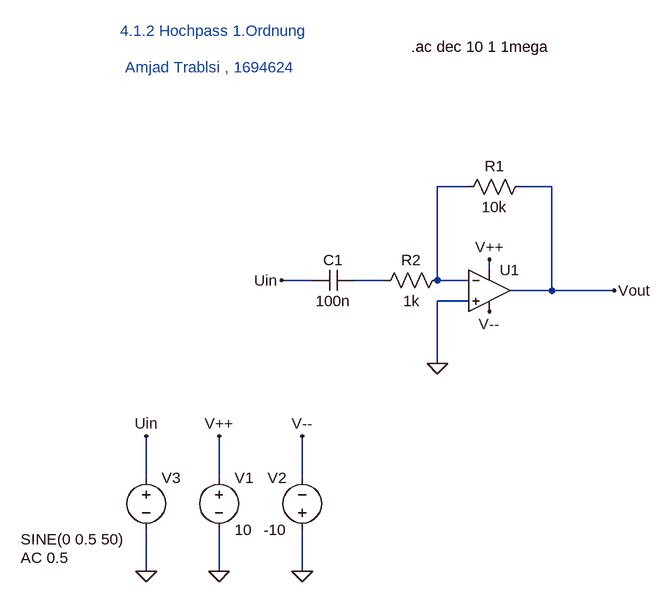
[diagram p0: schematic 4_1_2 hochpass_1_Ordnung_2.asc]
4_1_2 hochpass_1_Ordnung_2.asc, the LTspice schematic file:
Version 4
SHEET 1 1052 680
WIRE 512 -32 464 -32
WIRE 640 -32 592 -32
WIRE 544 96 544 80
WIRE 272 112 224 112
WIRE 384 112 336 112
WIRE 464 112 464 -32
WIRE 512 112 464 112
WIRE 640 128 640 -32
WIRE 640 128 576 128
WIRE 736 128 640 128
WIRE 512 144 464 144
WIRE 464 240 464 144
WIRE 16 416 16 352
WIRE 128 416 128 352
WIRE 256 416 256 352
WIRE 16 560 16 496
WIRE 128 560 128 496
WIRE 256 560 256 496
FLAG 128 560 0
FLAG 128 352 V++
FLAG 544 80 V++
FLAG 256 560 0
FLAG 256 352 V--
FLAG 544 160 V--
FLAG 736 128 Vout
FLAG 16 560 0
FLAG 16 352 Uin
FLAG 224 112 Uin
FLAG 464 240 0
SYMBOL res 608 -48 R90
WINDOW 0 0 56 VBottom 2
WINDOW 3 32 56 VTop 2
SYMATTR InstName R1
SYMATTR Value 10k
SYMBOL voltage 128 400 R0
WINDOW 123 0 0 Left 0
WINDOW 39 0 0 Left 0
SYMATTR InstName V1
SYMATTR Value 10
SYMBOL voltage 256 512 R180
WINDOW 0 24 96 Left 2
WINDOW 3 24 16 Left 2
WINDOW 123 0 0 Left 0
WINDOW 39 0 0 Left 0
SYMATTR InstName V2
SYMATTR Value -10
SYMBOL voltage 16 400 R0
WINDOW 3 -193 111 Left 2
WINDOW 123 -193 139 Left 2
WINDOW 39 0 0 Left 0
SYMATTR Value SINE(0 0.5 50)
SYMATTR Value2 AC 0.5
SYMATTR InstName V3
SYMBOL cap 336 96 R90
WINDOW 0 0 32 VBottom 2
WINDOW 3 32 32 VTop 2
SYMATTR InstName C1
SYMATTR Value 100n
SYMBOL res 480 96 R90
WINDOW 0 0 56 VBottom 2
WINDOW 3 32 56 VTop 2
SYMATTR InstName R2
SYMATTR Value 1k
SYMBOL OpAmps/UniversalOpAmp 544 128 R0
SYMATTR InstName U1
TEXT -24 -272 Left 2 ;4.1.2 Hochpass 1.Ordnung
TEXT 424 -248 Left 2 !.ac dec 10 1 1mega
TEXT -16 -216 Left 2 ;Amjad Trablsi , 1694624

The netlist it stands for:
* 4_1_2 hochpass_1_Ordnung_2.asc
R1 Vout N001 10k
V1 V++ 0 10
V2 0 V-- -10
V3 Uin 0 SINE(0 0.5 50) AC 0.5
C1 N002 Uin 100n
R2 N001 N002 1k
XU1 0 N001 V++ V-- Vout level1 Avol=1Meg GBW=10Meg Vos=0 En=0 Enk=0 In=0 Ink=0 Rin=500Meg  ; pins In+ In- V+ V- OUT
* 4.1.2 Hochpass 1.Ordnung
.ac dec 10 1 1mega
* Amjad Trablsi , 1694624
.lib UniversalOpAmp1.lib
.backanno
.end